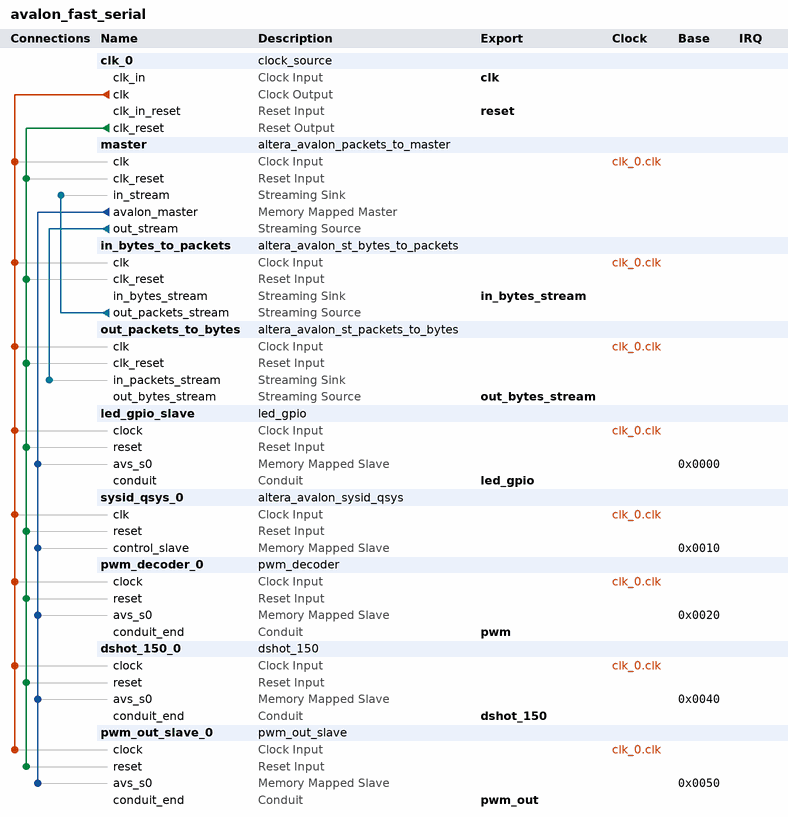
[diagram p0: system contents]
# Platform Designer (Qsys) system avalon_fast_serial, Cyclone 10 LP 10CL025YU256C8G
# Parameters at their usual value, and those the tool derives, are not listed.
package require -exact qsys 18.1
create_system avalon_fast_serial
set_project_property DEVICE_FAMILY {Cyclone 10 LP}
set_project_property DEVICE 10CL025YU256C8G

add_instance clk_0 clock_source 18.1
set_instance_parameter_value clk_0 clockFrequency 50000000

add_instance master altera_avalon_packets_to_master 18.1
set_instance_parameter_value master EXPORT_MASTER_SIGNALS 0
set_instance_parameter_value master FAST_VER 0
set_instance_parameter_value master FIFO_DEPTHS 2

add_instance in_bytes_to_packets altera_avalon_st_bytes_to_packets 18.1
set_instance_parameter_value in_bytes_to_packets CHANNEL_WIDTH 8
set_instance_parameter_value in_bytes_to_packets ENCODING 0

add_instance out_packets_to_bytes altera_avalon_st_packets_to_bytes 18.1
set_instance_parameter_value out_packets_to_bytes CHANNEL_WIDTH 8
set_instance_parameter_value out_packets_to_bytes ENCODING 0

add_instance led_gpio_slave led_gpio 1.0

add_instance sysid_qsys_0 altera_avalon_sysid_qsys 18.1
set_instance_parameter_value sysid_qsys_0 id 287454020

add_instance pwm_decoder_0 pwm_decoder 1.0

add_instance dshot_150_0 dshot_150 1.0

add_instance pwm_out_slave_0 pwm_out_slave 1.0

# connections
add_connection clk_0.clk dshot_150_0.clock clock
add_connection clk_0.clk in_bytes_to_packets.clk clock
add_connection clk_0.clk led_gpio_slave.clock clock
add_connection clk_0.clk master.clk clock
add_connection clk_0.clk out_packets_to_bytes.clk clock
add_connection clk_0.clk pwm_decoder_0.clock clock
add_connection clk_0.clk pwm_out_slave_0.clock clock
add_connection clk_0.clk sysid_qsys_0.clk clock
add_connection clk_0.clk_reset dshot_150_0.reset reset
add_connection clk_0.clk_reset in_bytes_to_packets.clk_reset reset
add_connection clk_0.clk_reset led_gpio_slave.reset reset
add_connection clk_0.clk_reset master.clk_reset reset
add_connection clk_0.clk_reset out_packets_to_bytes.clk_reset reset
add_connection clk_0.clk_reset pwm_decoder_0.reset reset
add_connection clk_0.clk_reset pwm_out_slave_0.reset reset
add_connection clk_0.clk_reset sysid_qsys_0.reset reset
add_connection master.avalon_master dshot_150_0.avs_s0 avalon
set_connection_parameter_value master.avalon_master/dshot_150_0.avs_s0 baseAddress 0x0040
add_connection master.avalon_master led_gpio_slave.avs_s0 avalon
set_connection_parameter_value master.avalon_master/led_gpio_slave.avs_s0 baseAddress 0x0000
add_connection master.avalon_master pwm_decoder_0.avs_s0 avalon
set_connection_parameter_value master.avalon_master/pwm_decoder_0.avs_s0 baseAddress 0x0020
add_connection master.avalon_master pwm_out_slave_0.avs_s0 avalon
set_connection_parameter_value master.avalon_master/pwm_out_slave_0.avs_s0 baseAddress 0x0050
add_connection master.avalon_master sysid_qsys_0.control_slave avalon
set_connection_parameter_value master.avalon_master/sysid_qsys_0.control_slave baseAddress 0x0010
add_connection in_bytes_to_packets.out_packets_stream master.in_stream avalon_streaming
add_connection master.out_stream out_packets_to_bytes.in_packets_stream avalon_streaming

# exported interfaces
add_interface clk clock sink
set_interface_property clk EXPORT_OF clk_0.clk_in
add_interface dshot_150 conduit end
set_interface_property dshot_150 EXPORT_OF dshot_150_0.conduit_end
add_interface in_bytes_stream avalon_streaming sink
set_interface_property in_bytes_stream EXPORT_OF in_bytes_to_packets.in_bytes_stream
add_interface led_gpio conduit end
set_interface_property led_gpio EXPORT_OF led_gpio_slave.conduit
add_interface out_bytes_stream avalon_streaming source
set_interface_property out_bytes_stream EXPORT_OF out_packets_to_bytes.out_bytes_stream
add_interface pwm conduit end
set_interface_property pwm EXPORT_OF pwm_decoder_0.conduit_end
add_interface pwm_out conduit end
set_interface_property pwm_out EXPORT_OF pwm_out_slave_0.conduit_end
add_interface reset reset sink
set_interface_property reset EXPORT_OF clk_0.clk_in_reset

set_interconnect_requirement {$system} qsys_mm.clockCrossingAdapter HANDSHAKE
set_interconnect_requirement {$system} qsys_mm.enableEccProtection FALSE
set_interconnect_requirement {$system} qsys_mm.insertDefaultSlave FALSE
set_interconnect_requirement {$system} qsys_mm.maxAdditionalLatency 1

save_system avalon_fast_serial.qsys
